# EAGLE design PMSX003-Breakout (EAGLE 8.1.0)
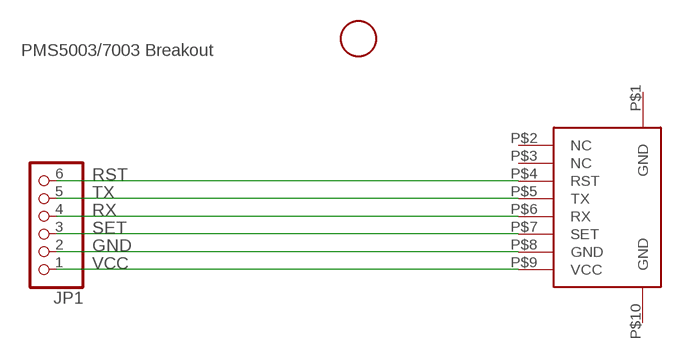
[diagram p0: schematic, sheet 1]

## Parts
JP1  PINHD-1X6  [1X06]
U$1  0532610871  [0532610871]
U$2  FIDUCIAL  [FIDUCIAL_1MM]

## Nets
GND: JP1.2 U$1.P$8(GND)
RST: JP1.6 U$1.P$4(RST)
RX: JP1.4 U$1.P$6(RX)
SET: JP1.3 U$1.P$7(SET)
TX: JP1.5 U$1.P$5(TX)
VCC: JP1.1 U$1.P$9(VCC)
Unconnected: U$1.P$1(GND) U$1.P$2(NC) U$1.P$3(NC) U$1.P$10(GND)

## Notes on the sheet
- PMS5003/7003 Breakout

## Library data of the parts
JP1 = adafruit:PINHD-1X6: PIN HEADER
U$1 = molex:0532610871: CONN HEADER 8POS 1.25MM R/A SMD This is a library for 8 pin Molex connector 1.25mm pitch). MPN 0532610871 Can be used to connect Plantower PMS3003/5003/7003 PM2.5 sensor Designed by Akram Ali https://github.com/akstudios
U$2 = adafruit:FIDUCIAL: For use by pick and place machines to calibrate the vision/machine, 1mm By microbuilder.eu

## Board
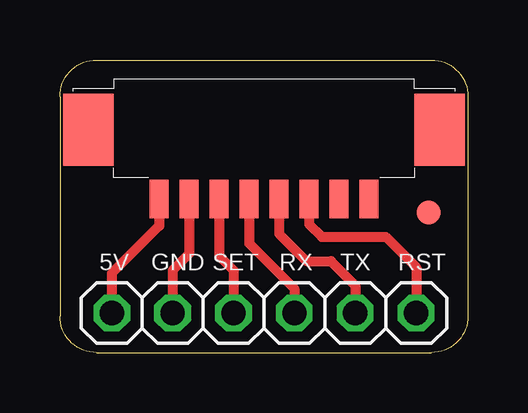
[diagram p1: board, top side]

Size 17.02 x 12.19 mm. Coordinates in mm from the lower left corner, seen from the top.
Outline: 0,10.67 0,1.52 arc90 1.52,0 15.49,0 arc90 17.02,1.52 17.02,10.67 arc90 15.49,12.19 1.52,12.19 arc90 0,10.67
Copper layers (1*16): Top 0.035mm / dielectric 1.5mm / Bottom 0.035mm
Design rules "default": minimum track width 10mil, minimum drill 24mil, track to track 8mil, track to pad 8mil, pad to pad 8mil, via to via 8mil, smd to smd 8mil, copper to edge 40mil, drill to drill 8mil, minimum pad ring 10mil, minimum via ring 8mil, stop-mask expansion 4mil, vias tented up to drill 0mil, thermal gap 10mil

### Footprints (pad centres in the part's own frame; a part is rotated, then mirrored left to right if it is on the bottom)
1X06 = drill 1.016 octagon: 1 -6.35,0; 2 -3.81,0; 3 -1.27,0; 4 1.27,0; 5 3.81,0; 6 6.35,0
0532610871 = smd 2.1 x 3: P$1 1.05,1.5; P$10 15.7,1.5 | smd 0.8 x 1.6: P$2 4,4.4; P$3 5.25,4.4; P$4 6.5,4.4; P$5 7.75,4.4; P$6 9,4.4; P$7 10.25,4.4; P$8 11.5,4.4; P$9 12.75,4.4
FIDUCIAL_1MM = smd 1 x 1: 1 0,0

### Placement (x,y rotation side)
JP1  8.51,1.65 0 top
U$1  16.89,10.79 180 top
U$2  15.37,5.84 0 top

### Tracks (layer width: path | path; a pad name or v marks a point on that pad's centre or on a via)
GND
  Top 0.406: U$1.P$8 5.39,4.12 4.7,3.43 JP1.2
RST
  Top 0.406: U$1.P$4 10.39,5.36 10.92,4.83 13.59,4.83 14.86,3.56 JP1.6
RX
  Top 0.406: U$1.P$6 7.89,4.55 9.78,2.67 JP1.4
SET
  Top 0.406: U$1.P$7 6.64,4.03 7.24,3.43 JP1.3
TX
  Top 0.406: U$1.P$5 9.14,4.96 10.29,3.81 11.3,3.81 12.32,2.79 JP1.5
VCC
  Top 0.406: U$1.P$9 4.14,5.28 2.16,3.3 JP1.1

### Text on the board
_tsilk: 5V | GND | SET | RX | TX | RST
_bsilk: PMSX003 Breakout | v0.1 | Designed by | Akram Ali